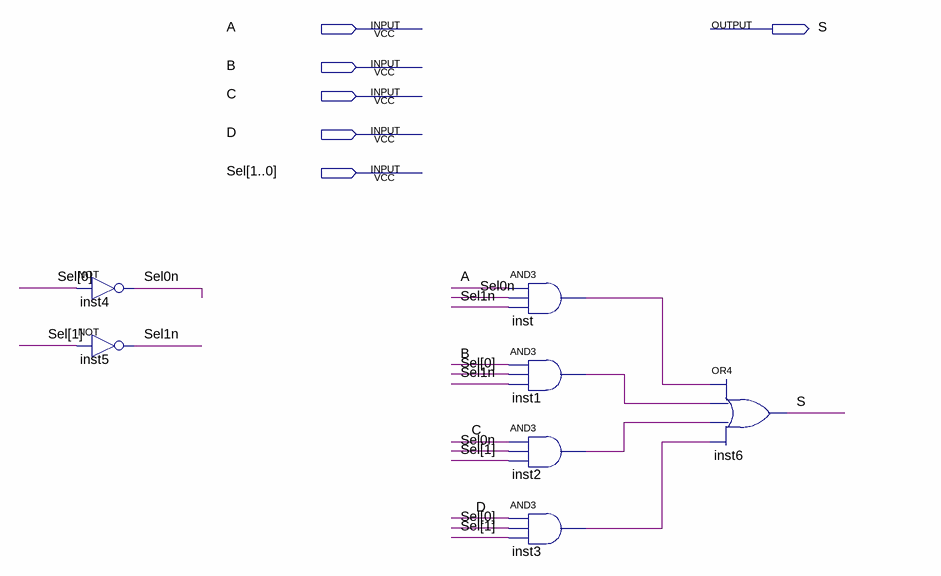
[diagram p0: schematic sheet]
// Quartus schematic MUX4_1.bdf as structural Verilog: 7 symbols, 6 pins
module MUX4_1 (
  input  A,
  input  B,
  input  C,
  input  D,
  input  [1:0] Sel,
  output S
);

  wire inst1_out, inst2_out, inst3_out, inst_out, Sel0n, Sel1n;

  not inst4 (Sel0n, Sel[0]);
  not inst5 (Sel1n, Sel[1]);
  and inst (inst_out, A, Sel0n, Sel1n);
  and inst1 (inst1_out, B, Sel[0], Sel1n);
  and inst2 (inst2_out, C, Sel0n, Sel[1]);
  and inst3 (inst3_out, D, Sel[0], Sel[1]);
  or inst6 (S, inst_out, inst1_out, inst2_out, inst3_out);
endmodule
